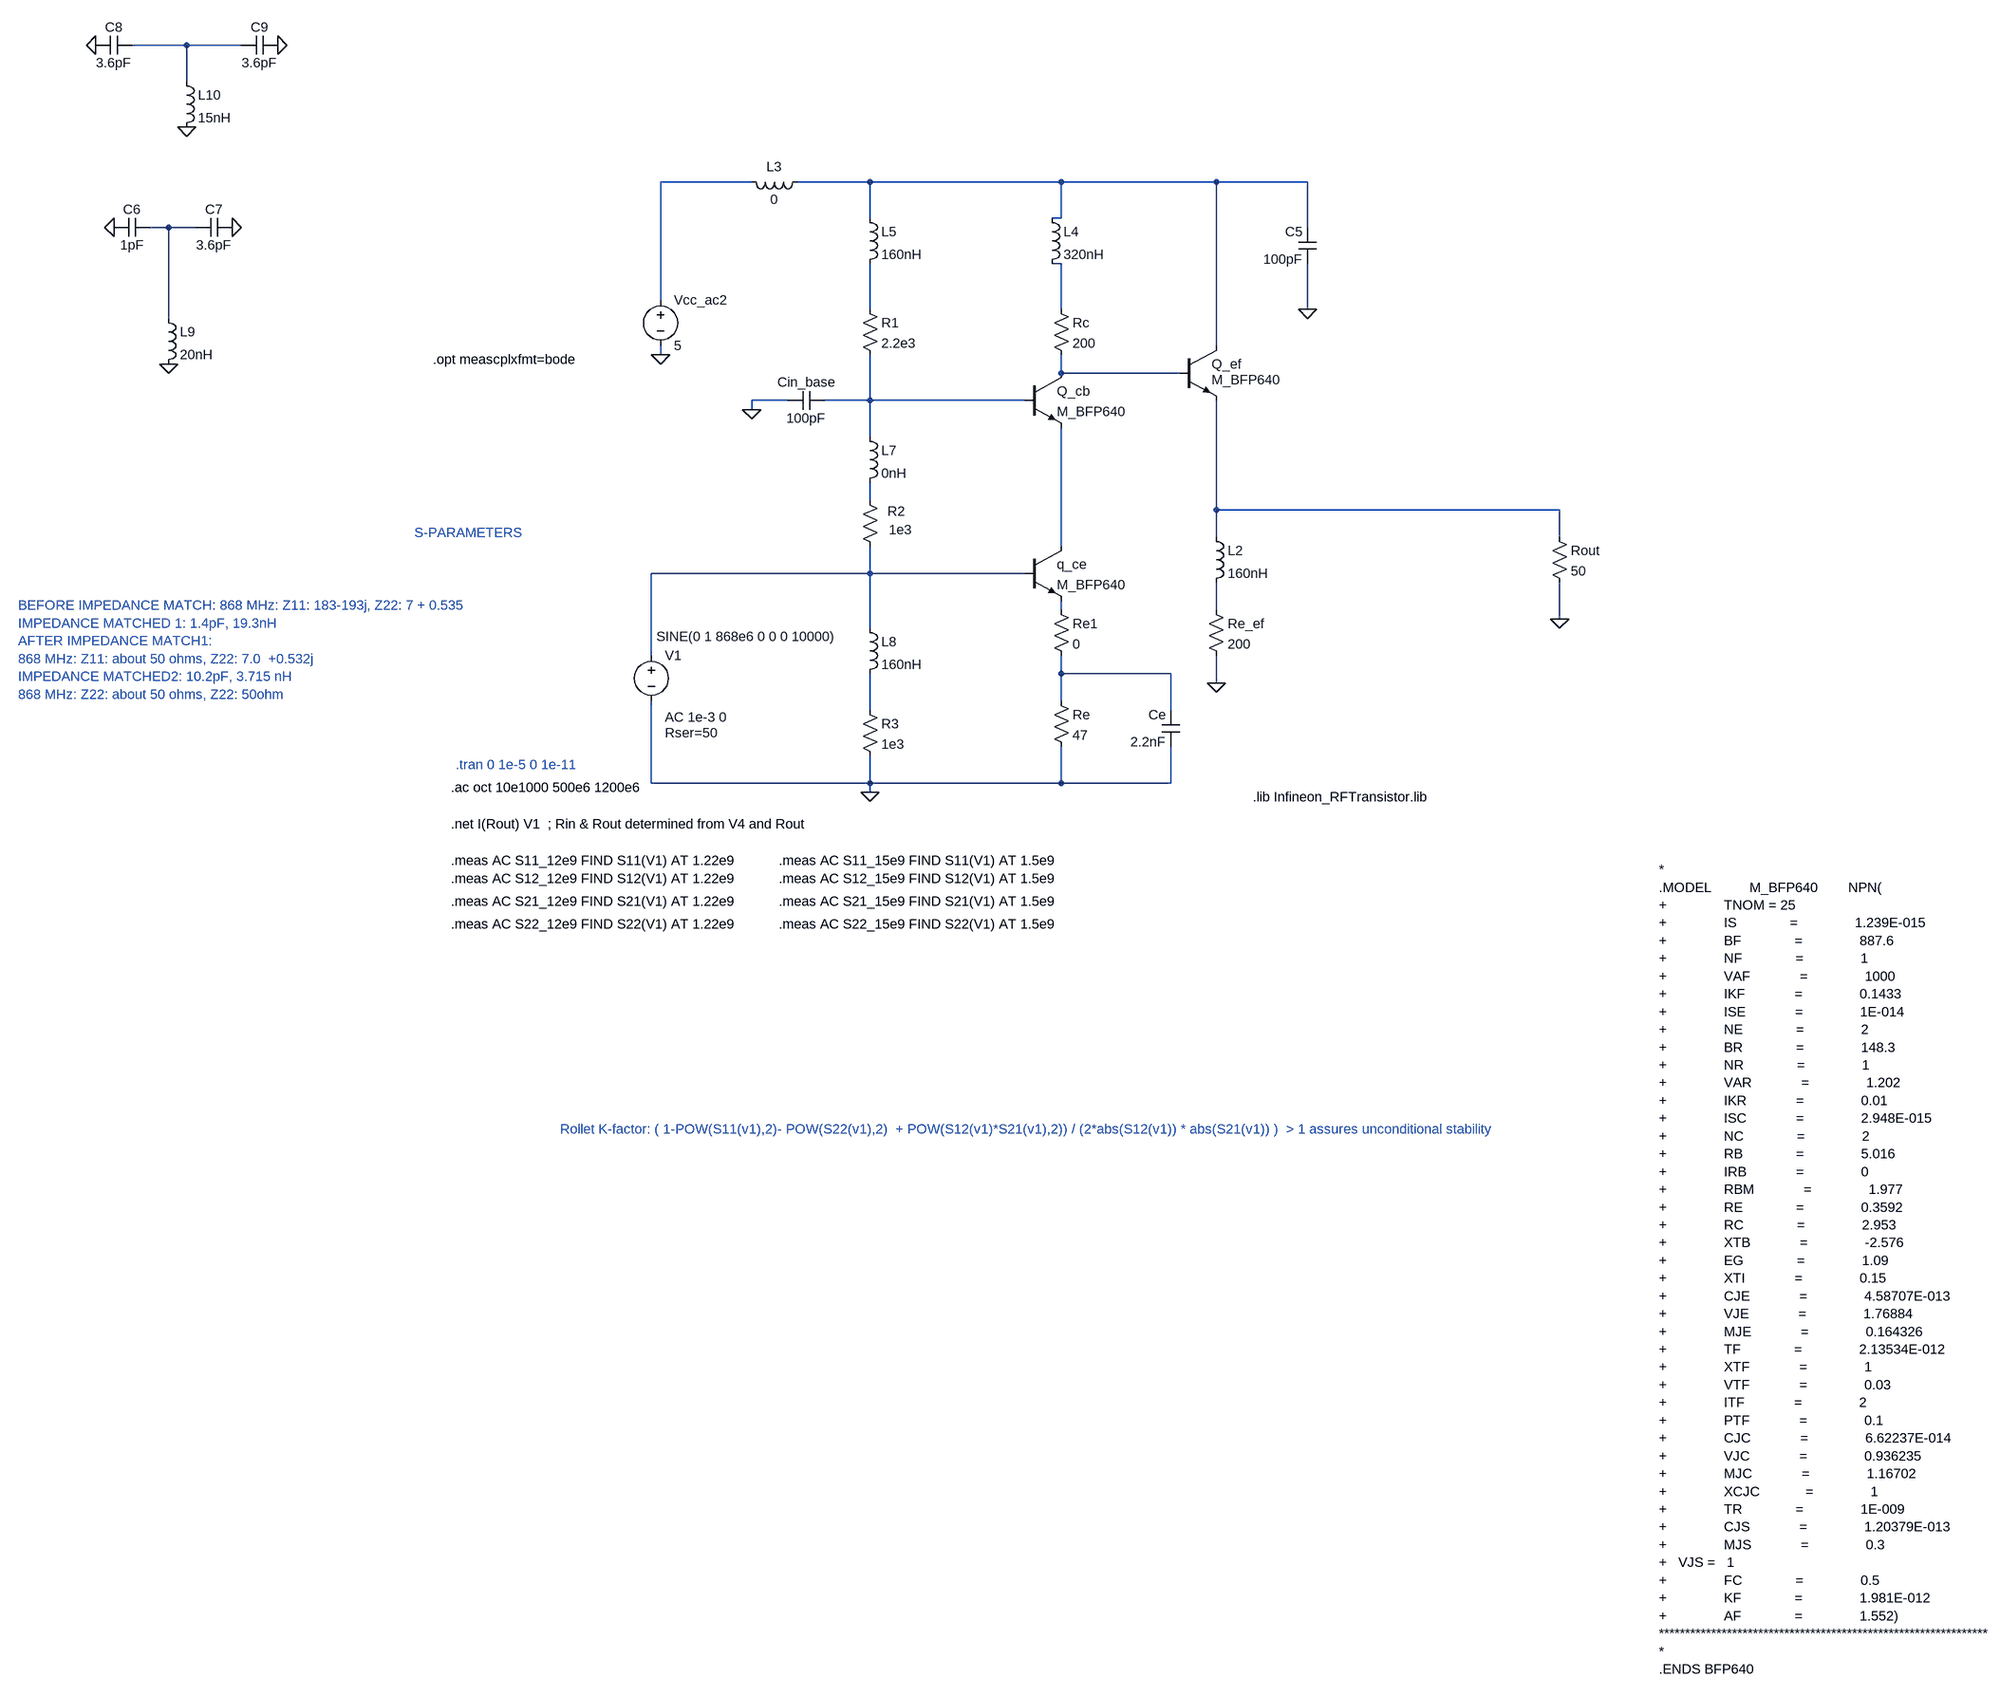
[diagram p0: schematic LNA_IMPEDANCE_CALC.asc]
LNA_IMPEDANCE_CALC.asc, the LTspice schematic file:
Version 4
SHEET 1 3348 3192
WIRE -1280 -80 -1376 -80
WIRE -1184 -80 -1280 -80
WIRE -1280 -16 -1280 -80
WIRE -288 160 -448 160
WIRE -80 160 -208 160
WIRE 256 160 -80 160
WIRE 528 160 256 160
WIRE 688 160 528 160
WIRE -80 224 -80 160
WIRE 256 224 256 160
WIRE 256 224 240 224
WIRE -1312 240 -1344 240
WIRE -1264 240 -1312 240
WIRE 688 240 688 160
WIRE 256 304 240 304
WIRE -448 368 -448 160
WIRE -80 384 -80 304
WIRE 256 384 256 304
WIRE 688 384 688 304
WIRE -1312 400 -1312 240
WIRE 528 448 528 160
WIRE -448 464 -448 448
WIRE 256 496 256 464
WIRE 464 496 256 496
WIRE -224 544 -288 544
WIRE -80 544 -80 464
WIRE -80 544 -160 544
WIRE 192 544 -80 544
WIRE -288 560 -288 544
WIRE -80 608 -80 544
WIRE -80 720 -80 688
WIRE 528 736 528 544
WIRE 1296 736 528 736
WIRE 528 784 528 736
WIRE 1296 784 1296 736
WIRE 256 800 256 592
WIRE -80 848 -80 800
WIRE -80 848 -464 848
WIRE 192 848 -80 848
WIRE 256 912 256 896
WIRE 528 912 528 864
WIRE 1296 928 1296 864
WIRE -80 944 -80 848
WIRE -464 992 -464 848
WIRE 256 1024 256 992
WIRE 448 1024 256 1024
WIRE 528 1040 528 992
WIRE 256 1072 256 1024
WIRE -80 1088 -80 1024
WIRE 448 1088 448 1024
WIRE -464 1216 -464 1072
WIRE -80 1216 -80 1168
WIRE -80 1216 -464 1216
WIRE 256 1216 256 1152
WIRE 256 1216 -80 1216
WIRE 448 1216 448 1152
WIRE 448 1216 256 1216
WIRE -80 1232 -80 1216
FLAG -448 464 0
FLAG -80 1232 0
FLAG -288 560 0
FLAG 528 1040 0
FLAG 688 384 0
FLAG 1296 928 0
FLAG -1200 240 0
FLAG -1312 480 0
FLAG -1408 240 0
FLAG -1120 -80 0
FLAG -1280 64 0
FLAG -1440 -80 0
DATAFLAG -80 592 ""
SYMBOL voltage -448 352 R0
WINDOW 123 0 0 Left 0
WINDOW 39 0 0 Left 0
SYMATTR InstName Vcc_ac2
SYMATTR Value 5
SYMBOL npn 192 800 R0
SYMATTR InstName q_ce
SYMATTR Value M_BFP640
SYMBOL res -96 368 R0
SYMATTR InstName R1
SYMATTR Value 2.2e3
SYMBOL res -96 1072 R0
SYMATTR InstName R3
SYMATTR Value 1e3
SYMBOL res 240 1056 R0
SYMATTR InstName Re
SYMATTR Value 47
SYMBOL res 240 368 R0
SYMATTR InstName Rc
SYMATTR Value 200
SYMBOL res -96 704 R0
WINDOW 0 47 35 Left 2
WINDOW 3 49 67 Left 2
SYMATTR InstName R2
SYMATTR Value 1e3
SYMBOL npn 192 496 R0
SYMATTR InstName Q_cb
SYMATTR Value M_BFP640
SYMBOL cap -160 528 R90
WINDOW 0 0 32 VBottom 2
WINDOW 3 32 32 VTop 2
SYMATTR InstName Cin_base
SYMATTR Value 100pF
SYMBOL cap 464 1152 R180
WINDOW 0 24 56 Left 2
WINDOW 3 24 8 Left 2
SYMATTR InstName Ce
SYMATTR Value 2.2nF
SYMBOL npn 464 448 R0
WINDOW 3 56 60 Left 2
SYMATTR Value M_BFP640
SYMATTR InstName Q_ef
SYMBOL res 512 896 R0
SYMATTR InstName Re_ef
SYMATTR Value 200
SYMBOL res 1280 768 R0
SYMATTR InstName Rout
SYMATTR Value 50
SYMBOL voltage -464 976 R0
WINDOW 123 24 124 Left 2
WINDOW 39 24 152 Left 2
WINDOW 3 9 -17 Left 2
SYMATTR Value2 AC 1e-3 0
SYMATTR SpiceLine Rser=50
SYMATTR Value SINE(0 1 868e6 0 0 0 10000)
SYMATTR InstName V1
SYMBOL ind -192 144 R90
WINDOW 0 5 56 VBottom 2
WINDOW 3 32 56 VTop 2
SYMATTR InstName L3
SYMATTR Value 0
SYMBOL ind 224 208 R0
SYMATTR InstName L4
SYMATTR Value 320nH
SYMBOL ind -96 592 R0
SYMATTR InstName L7
SYMATTR Value 0nH
SYMBOL ind -96 928 R0
SYMATTR InstName L8
SYMATTR Value 160nH
SYMBOL ind -96 208 R0
SYMATTR InstName L5
SYMATTR Value 160nH
SYMBOL cap 704 304 R180
WINDOW 0 24 56 Left 2
WINDOW 3 24 8 Left 2
SYMATTR InstName C5
SYMATTR Value 100pF
SYMBOL ind 512 768 R0
SYMATTR InstName L2
SYMATTR Value 160nH
SYMBOL res 240 896 R0
SYMATTR InstName Re1
SYMATTR Value 0
SYMBOL cap -1344 224 R90
WINDOW 0 0 32 VBottom 2
WINDOW 3 32 32 VTop 2
SYMATTR InstName C6
SYMATTR Value 1pF
SYMBOL ind -1328 384 R0
SYMATTR InstName L9
SYMATTR Value 20nH
SYMBOL cap -1200 224 R90
WINDOW 0 0 32 VBottom 2
WINDOW 3 32 32 VTop 2
SYMATTR InstName C7
SYMATTR Value 3.6pF
SYMBOL cap -1376 -96 R90
WINDOW 0 0 32 VBottom 2
WINDOW 3 32 32 VTop 2
SYMATTR InstName C8
SYMATTR Value 3.6pF
SYMBOL cap -1120 -96 R90
WINDOW 0 0 32 VBottom 2
WINDOW 3 32 32 VTop 2
SYMATTR InstName C9
SYMATTR Value 3.6pF
SYMBOL ind -1296 -32 R0
SYMATTR InstName L10
SYMATTR Value 15nH
TEXT -816 1224 Left 2 !.ac oct 10e1000 500e6 1200e6
TEXT -816 1288 Left 2 !.net I(Rout) V1  ; Rin & Rout determined from V4 and Rout
TEXT -880 776 Left 2 ;S-PARAMETERS
TEXT -816 1352 Left 2 !.meas AC S11_12e9 FIND S11(V1) AT 1.22e9
TEXT -848 472 Left 2 !.opt meascplxfmt=bode
TEXT -816 1384 Left 2 !.meas AC S12_12e9 FIND S12(V1) AT 1.22e9
TEXT -816 1424 Left 2 !.meas AC S21_12e9 FIND S21(V1) AT 1.22e9
TEXT -816 1464 Left 2 !.meas AC S22_12e9 FIND S22(V1) AT 1.22e9
TEXT -240 1352 Left 2 !.meas AC S11_15e9 FIND S11(V1) AT 1.5e9
TEXT -240 1384 Left 2 !.meas AC S12_15e9 FIND S12(V1) AT 1.5e9
TEXT -240 1424 Left 2 !.meas AC S21_15e9 FIND S21(V1) AT 1.5e9
TEXT -240 1464 Left 2 !.meas AC S22_15e9 FIND S22(V1) AT 1.5e9
TEXT 592 1240 Left 2 !.lib Infineon_RFTransistor.lib
TEXT 2424 1368 Left 2 !*\n.MODEL          M_BFP640        NPN(\n+               TNOM = 25\n+               IS              =               1.239E-015\n+               BF              =               887.6\n+               NF              =               1\n+               VAF             =               1000\n+               IKF             =               0.1433\n+               ISE             =               1E-014\n+               NE              =               2\n+               BR              =               148.3\n+               NR              =               1\n+               VAR             =               1.202\n+               IKR             =               0.01\n+               ISC             =               2.948E-015\n+               NC              =               2\n+               RB              =               5.016\n+               IRB             =               0\n+               RBM             =               1.977\n+               RE              =               0.3592\n+               RC              =               2.953\n+               XTB             =               -2.576\n+               EG              =               1.09\n+               XTI             =               0.15\n+               CJE             =               4.58707E-013\n+               VJE             =               1.76884\n+               MJE             =               0.164326\n+               TF              =               2.13534E-012\n+               XTF             =               1\n+               VTF             =               0.03\n+               ITF             =               2\n+               PTF             =               0.1\n+               CJC             =               6.62237E-014\n+               VJC             =               0.936235\n+               MJC             =               1.16702\n+               XCJC            =               1\n+               TR              =               1E-009\n+               CJS             =               1.20379E-013\n+               MJS             =               0.3\n+   VJS =   1\n+               FC              =               0.5\n+               KF              =               1.981E-012\n+               AF              =               1.552)\n***************************************************************\n*\n.ENDS BFP640
TEXT -1576 904 Left 2 ;BEFORE IMPEDANCE MATCH: 868 MHz: Z11: 183-193j, Z22: 7 + 0.535\nIMPEDANCE MATCHED 1: 1.4pF, 19.3nH\nAFTER IMPEDANCE MATCH1: \n868 MHz: Z11: about 50 ohms, Z22: 7.0  +0.532j\nIMPEDANCE MATCHED2: 10.2pF, 3.715 nH\n868 MHz: Z22: about 50 ohms, Z22: 50ohm
TEXT -808 1184 Left 2 ;.tran 0 1e-5 0 1e-11
TEXT -624 1824 Left 2 ;Rollet K-factor: ( 1-POW(S11(v1),2)- POW(S22(v1),2)  + POW(S12(v1)*S21(v1),2)) / (2*abs(S12(v1)) * abs(S21(v1)) )  > 1 assures unconditional stability

The netlist it stands for:
* LNA_IMPEDANCE_CALC.asc
Vcc_ac2 N002 0 5
q_ce N011 N012 N013 0 M_BFP640
R1 N006 N008 2.2e3
R3 N016 0 1e3
Re N015 0 47
Rc N005 N007 200
R2 N009 N012 1e3
Q_cb N007 N008 N011 0 M_BFP640
Cin_base N008 0 100pF
Ce 0 N015 2.2nF
Q_ef N003 N007 N010 0 M_BFP640
Re_ef N014 0 200
Rout N010 0 50
V1 N012 0 SINE(0 1 868e6 0 0 0 10000) AC 1e-3 0 Rser=50
L3 N003 N002 0
L4 N003 N005 320nH
L7 N008 N009 0nH
L8 N012 N016 160nH
L5 N003 N006 160nH
C5 0 N003 100pF
L2 N010 N014 160nH
Re1 N013 N015 0
C6 N004 0 1pF
L9 N004 0 20nH
C7 0 N004 3.6pF
C8 N001 0 3.6pF
C9 0 N001 3.6pF
L10 N001 0 15nH
.model NPN NPN
.model PNP PNP
.lib standard.bjt
.ac oct 10e1000 500e6 1200e6
.net I(Rout) V1  ; Rin & Rout determined from V4 and Rout
* S-PARAMETERS
.meas AC S11_12e9 FIND S11(V1) AT 1.22e9
.opt meascplxfmt=bode
.meas AC S12_12e9 FIND S12(V1) AT 1.22e9
.meas AC S21_12e9 FIND S21(V1) AT 1.22e9
.meas AC S22_12e9 FIND S22(V1) AT 1.22e9
.meas AC S11_15e9 FIND S11(V1) AT 1.5e9
.meas AC S12_15e9 FIND S12(V1) AT 1.5e9
.meas AC S21_15e9 FIND S21(V1) AT 1.5e9
.meas AC S22_15e9 FIND S22(V1) AT 1.5e9
.lib Infineon_RFTransistor.lib
*
.MODEL          M_BFP640        NPN(
+               TNOM = 25
+               IS              =               1.239E-015
+               BF              =               887.6
+               NF              =               1
+               VAF             =               1000
+               IKF             =               0.1433
+               ISE             =               1E-014
+               NE              =               2
+               BR              =               148.3
+               NR              =               1
+               VAR             =               1.202
+               IKR             =               0.01
+               ISC             =               2.948E-015
+               NC              =               2
+               RB              =               5.016
+               IRB             =               0
+               RBM             =               1.977
+               RE              =               0.3592
+               RC              =               2.953
+               XTB             =               -2.576
+               EG              =               1.09
+               XTI             =               0.15
+               CJE             =               4.58707E-013
+               VJE             =               1.76884
+               MJE             =               0.164326
+               TF              =               2.13534E-012
+               XTF             =               1
+               VTF             =               0.03
+               ITF             =               2
+               PTF             =               0.1
+               CJC             =               6.62237E-014
+               VJC             =               0.936235
+               MJC             =               1.16702
+               XCJC            =               1
+               TR              =               1E-009
+               CJS             =               1.20379E-013
+               MJS             =               0.3
+   VJS =   1
+               FC              =               0.5
+               KF              =               1.981E-012
+               AF              =               1.552)
***************************************************************
*
.ENDS BFP640
* BEFORE IMPEDANCE MATCH: 868 MHz: Z11: 183-193j, Z22: 7 + 0.535
* IMPEDANCE MATCHED 1: 1.4pF, 19.3nH
* AFTER IMPEDANCE MATCH1:
* 868 MHz: Z11: about 50 ohms, Z22: 7.0  +0.532j
* IMPEDANCE MATCHED2: 10.2pF, 3.715 nH
* 868 MHz: Z22: about 50 ohms, Z22: 50ohm
* .tran 0 1e-5 0 1e-11
* Rollet K-factor: ( 1-POW(S11(v1),2)- POW(S22(v1),2)  + POW(S12(v1)*S21(v1),2)) / (2*abs(S12(v1)) * abs(S21(v1)) )  > 1 assures unconditional stability
.backanno
.end